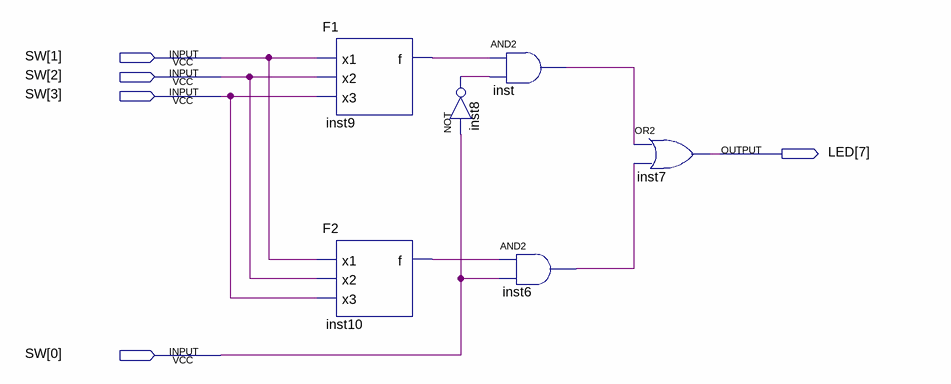
[diagram p0: schematic sheet]
// Quartus schematic EDWARD4.bdf as structural Verilog: 6 symbols, 5 pins
module EDWARD4 (
  input  [3:0] SW,
  output [7:7] LED
);

  wire inst6_out, inst8_out, inst9_f, inst10_f, inst_out;

  F1 inst9 (.x1(SW[1]), .x2(SW[2]), .x3(SW[3]), .f(inst9_f));
  F2 inst10 (.x1(SW[1]), .x2(SW[2]), .x3(SW[3]), .f(inst10_f));
  not inst8 (inst8_out, SW[0]);
  and inst (inst_out, inst9_f, inst8_out);
  and inst6 (inst6_out, inst10_f, SW[0]);
  or inst7 (LED[7], inst_out, inst6_out);
endmodule
